# Altium project LED_driver_150W_LT3756-2.PrjPcb
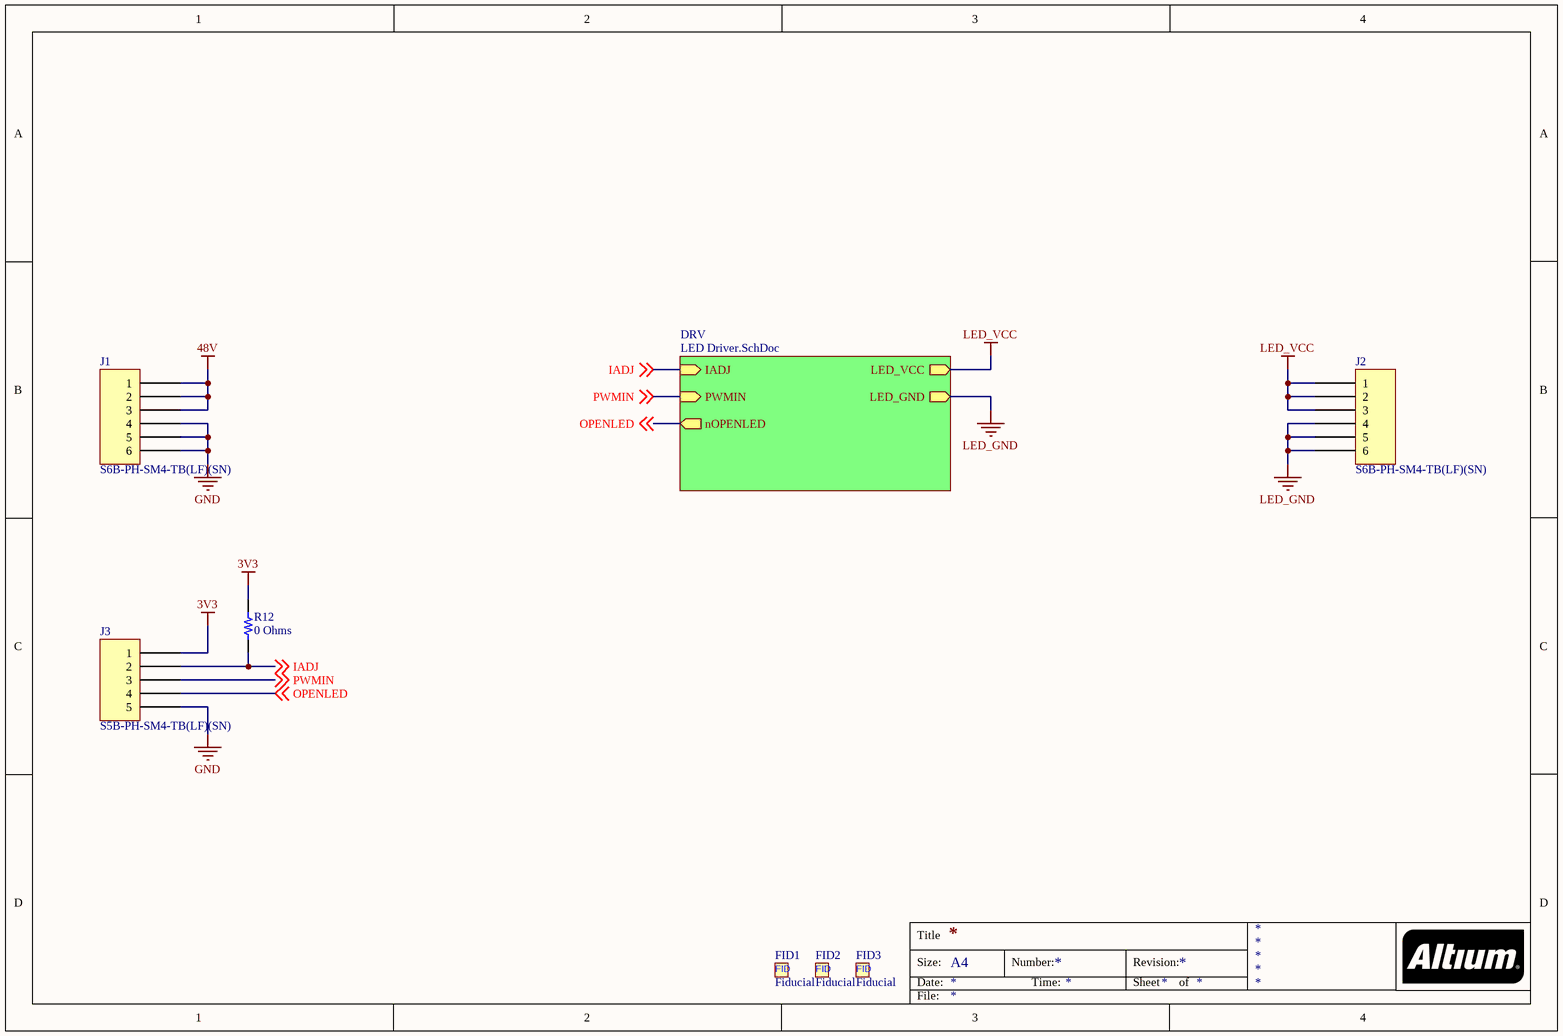
[diagram p0: Connections.SchDoc]
2 sheets, 37 parts. Net scope: hierarchical (ports join the sheet entries above them; power ports are global).
Board file: 150W LED Driver.PcbDoc
Sheets:
  Connections.SchDoc
    DRV = LED Driver.SchDoc

## Sheet Connections.SchDoc
size A4

### Parts
FID1  Fiducial  [Fiducial]  (no BOM)
FID2  Fiducial  [Fiducial]  (no BOM)
FID3  Fiducial  [Fiducial]  (no BOM)
J1  S6B-PH-SM4-TB(LF)(SN)  [JST S6B-PH-SM4-TB]
J2  S6B-PH-SM4-TB(LF)(SN)  [JST S6B-PH-SM4-TB]
J3  S5B-PH-SM4-TB(LF)(SN)  [JST S5B-PH-SM4-TB]
R12  0 Ohms  [RES 0603_1608]

### Sub-sheets
DRV = LED Driver.SchDoc: IADJ (in), nOPENLED (out), PWMIN (in), LED_VCC (out), LED_GND (out)

### Nets
3V3: J3.1 R12.2
48V: J1.1 J1.2 J1.3
GND: J1.4 J1.5 J1.6 J3.5
LED_GND: J2.4 J2.5 J2.6 ; sheet DRV/LED_GND
LED_VCC: J2.1 J2.2 J2.3 ; sheet DRV/LED_VCC  [project net ISN]
IADJ: J3.2 R12.1 ; off-sheet IADJ, sheet DRV/IADJ
OPENLED: J3.4 ; off-sheet OPENLED, sheet DRV/nOPENLED
PWMIN: J3.3 ; off-sheet PWMIN, sheet DRV/PWMIN

### Notes on the sheet
- Title
- Size:
- Date:
- A4
- Number:
- Time:
- Revision:
- Sheet
- of
- File:
- (in symbol Fiducial) FID

### Library data of the parts
J1 J2 = S6B-PH-SM4-TB(LF)(SN): CONN HEADER SMD R/A 6POS 2MM; Manufacturer: JST Sales America Inc.; Contact Length - Mating: 0.130" (3.30mm); Current Rating (Amps): 2A; Material Flammability Rating: UL94 V-0; Number of Positions: 6; Number of Positions Loaded: All; Pitch - Mating: 0.079" (2.00mm); Shrouding: Shrouded - 4 Wall; Style: Board to Cable/Wire; Voltage Rating: 100V; Part Number: S6B-PH-SM4-TB(LF)(SN); ComponentLink1Description: Datasheet; ComponentLink1URL: http://www.jst-mfg.com/product/pdf/eng/ePH.pdf; ComponentLink2Description: DigiKey Link; ComponentLink2URL: http://digikey.com/product-detail/en/jst-sales-america-inc/S6B-PH-SM4-TB-LF-SN/455-1753-1-ND/926850; Connector Type: Header; Contact Finish - Mating: Tin; Contact Finish - Post: Tin; Contact Material: Copper Alloy; Contact Shape: Square; Contact Type: Male Pin; Fastening Type: Detent Lock; Features: Solder Retention; Insulation Color: Natural; Insulation Height: 0.217" (5.51mm); Insulation Material: Polyamide (PA6T), Nylon 6T; LastUpdated: 15/01/2020 03:38:11; Lifecycle Status: Active; Minimum Order: 1; Mounting Type: Surface Mount, Right Angle; Number of Rows: 1; Operating Temperature: -25°C ~ 85°C; Packaging: TapeAndReel; PartId: 112; Part Status: Active; Price: 0.45; Series: PH; Supplier 1: DigiKey; Supplier Part Number 1: 455-1753-1-ND; Termination: Solder
J3 = S5B-PH-SM4-TB(LF)(SN): CONN HEADER SMD R/A 5POS 2MM; Manufacturer: JST Sales America Inc.; Contact Length - Mating: 0.130" (3.30mm); Current Rating (Amps): 2A; Material Flammability Rating: UL94 V-0; Number of Positions: 5; Number of Positions Loaded: All; Pitch - Mating: 0.079" (2.00mm); Shrouding: Shrouded - 4 Wall; Style: Board to Cable/Wire; Voltage Rating: 100V; Part Number: S5B-PH-SM4-TB(LF)(SN); ComponentLink1Description: Datasheet; ComponentLink1URL: http://www.jst-mfg.com/product/pdf/eng/ePH.pdf; ComponentLink2Description: DigiKey Link; ComponentLink2URL: http://digikey.com/product-detail/en/jst-sales-america-inc/S5B-PH-SM4-TB-LF-SN/455-1752-1-ND/926849; Connector Type: Header; Contact Finish - Mating: Tin; Contact Finish - Post: Tin; Contact Material: Copper Alloy; Contact Shape: Square; Contact Type: Male Pin; Fastening Type: Detent Lock; Features: Solder Retention; Insulation Color: Natural; Insulation Height: 0.217" (5.51mm); Insulation Material: Polyamide (PA6T), Nylon 6T; LastUpdated: 15/01/2020 03:45:44; Lifecycle Status: Active; Minimum Order: 1; Mounting Type: Surface Mount, Right Angle; Number of Rows: 1; Operating Temperature: -25°C ~ 85°C; Packaging: TapeAndReel; PartId: 118; Part Status: Active; Price: 0.39; Series: PH; Supplier 1: DigiKey; Supplier Part Number 1: 455-1752-1-ND; Termination: Solder
R12 = ERJ-3GEY0R00V: RES SMD 0 OHM JUMPER 1/10W 0603; Manufacturer: Panasonic Electronic Components; Power (Watts): 0.1W, 1/10W; Part Number: ERJ-3GEY0R00V; Value: 0 Ohms; ComponentLink1Description: Datasheet; ComponentLink1URL: http://industrial.panasonic.com/www-cgi/jvcr13pz.cgi?E+PZ+3+AOA0001+ERJ3GEY0R00V+7+WW; ComponentLink2Description: DigiKey Link; ComponentLink2URL: http://digikey.com/product-detail/en/panasonic-electronic-components/ERJ-3GEY0R00V/P0.0GCT-ND/134711; Composition: Thick Film; Device Package: 0603 (1608 Metric); Features: Automotive AEC-Q200; Height - Seated (Max): 0.022" (0.55mm); LastUpdated: 15/01/2020 00:08:11; Lifecycle Status: Active; Minimum Order: 1; Number of Terminations: 2; Operating Temperature: -55°C ~ 155°C; Package / Case: 0603 (1608 Metric); Packaging: TapeAndReel; PartId: 22603; Part Status: Active; Price: 0.01; Ratings: AEC-Q200; Resistance: 0 Ohms; Series: ERJ; Size / Dimension: 0.063" L x 0.031" W (1.60mm x 0.80mm); Supplier 1: DigiKey; Supplier Part Number 1: P0.0GCT-ND; Supplier Device Package: 0603; Tolerance: Jumper

## Sheet LED Driver.SchDoc: 150W LED Driver
size A4; DocumentNumber: 0; Revision: 0
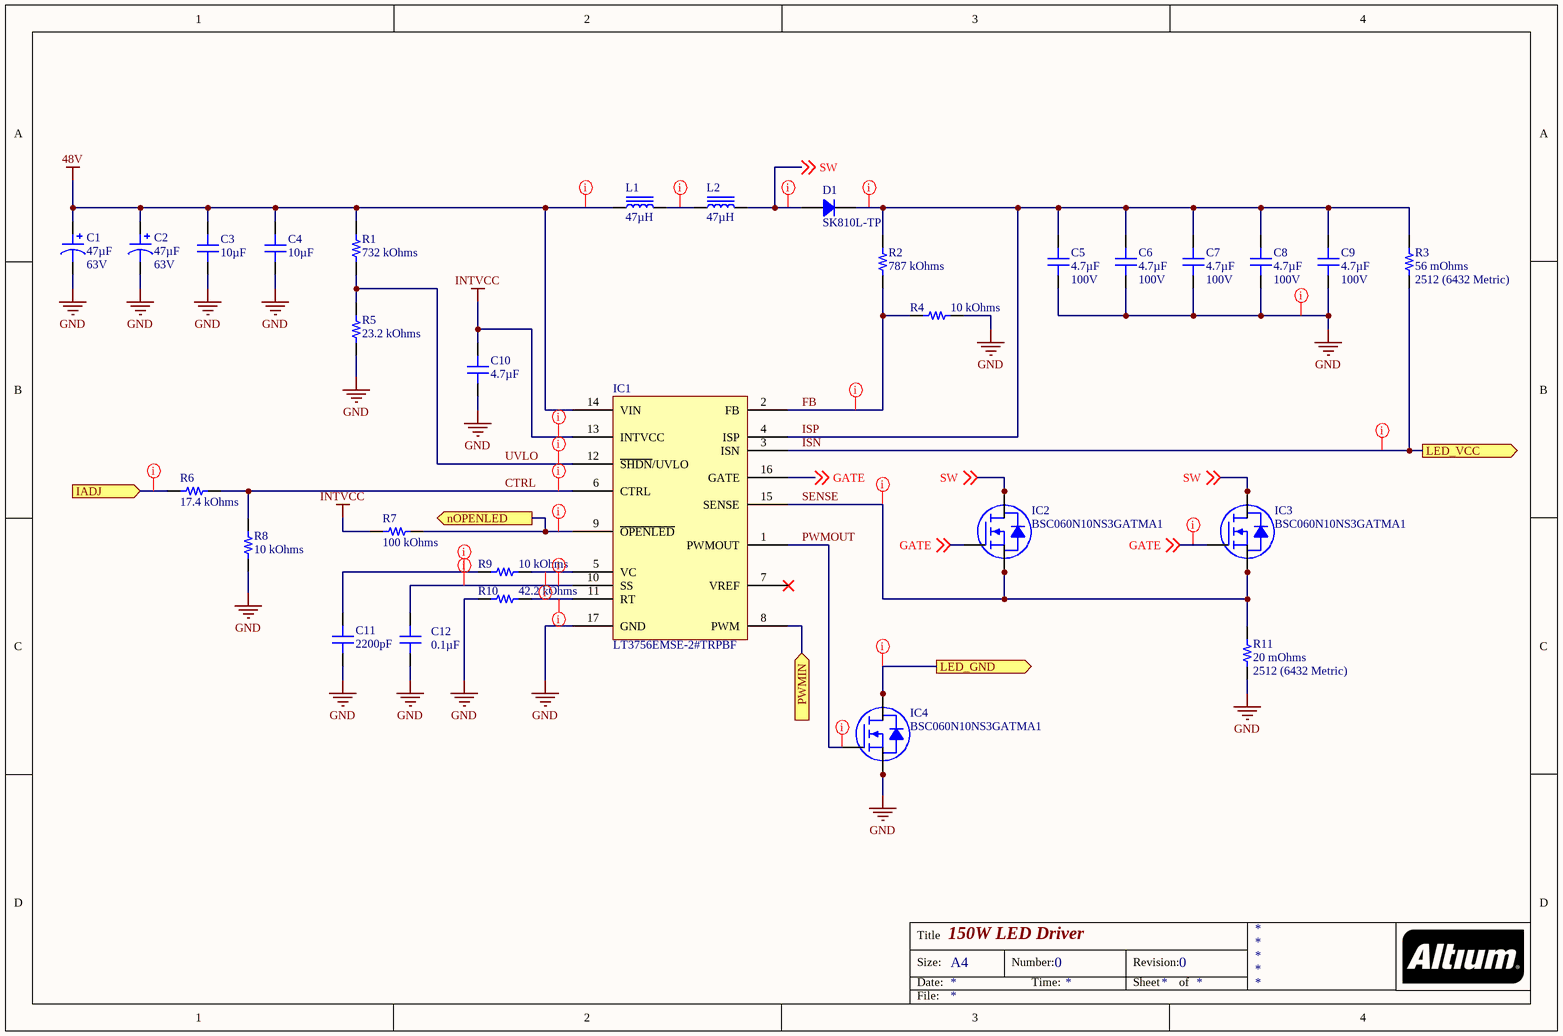
[diagram p1: LED Driver.SchDoc]

### Parts
C1  47µF  Voltage - Rated: 63V  [CAP ALSMD 8.3MM H10.5MM]
C2  47µF  Voltage - Rated: 63V  [CAP ALSMD 8.3MM H10.5MM]
C3  10µF  [CAP 1210_3225 - 2.8MM]
C4  10µF  [CAP 1210_3225 - 2.8MM]
C5  Voltage - Rated: 100V  [CAP 1210_3225 - 2.8MM]  (hidden comment: 4.7µF)
C6  Voltage - Rated: 100V  [CAP 1210_3225 - 2.8MM]  (hidden comment: 4.7µF)
C7  Voltage - Rated: 100V  [CAP 1210_3225 - 2.8MM]  (hidden comment: 4.7µF)
C8  Voltage - Rated: 100V  [CAP 1210_3225 - 2.8MM]  (hidden comment: 4.7µF)
C9  Voltage - Rated: 100V  [CAP 1210_3225 - 2.8MM]  (hidden comment: 4.7µF)
C10  4.7µF  [CAP 0402_1005]
C11  2200pF  [CAP 0402_1005]
C12  0.1µF  [CAP 0402_1005]
D1  SK810L-TP  [DO214AB SMC]
IC1  LT3756EMSE-2#TRPBF  [LTC MSOP-16 MSE16]
IC2  BSC060N10NS3GATMA1  [INFINEON PG-TDSON-8]
IC3  BSC060N10NS3GATMA1  [INFINEON PG-TDSON-8]
IC4  BSC060N10NS3GATMA1  [INFINEON PG-TDSON-8]
L1  47µH  [WURTH WE-HCF 14.5MM]
L2  47µH  [WURTH WE-HCF 14.5MM]
R1  732 kOhms  [RES 0402_1005]
R2  787 kOhms  [RES 0402_1005]
R3  56 mOhms  Package / Case: 2512 (6432 Metric)  [STACKPOLE CSR2512]
R4  10 kOhms  [RES 0402_1005]
R5  23.2 kOhms  [RES 0402_1005]
R6  17.4 kOhms  [RES 0402_1005]
R7  100 kOhms  [RES 0402_1005]
R8  10 kOhms  [RES 0402_1005]
R9  10 kOhms  [RES 0402_1005]
R10  42.2 kOhms  [RES 0402_1005]
R11  20 mOhms  Package / Case: 2512 (6432 Metric)  [STACKPOLE CSR2512]

### Ports
IADJ (in), LED_GND (out), LED_VCC (out), nOPENLED (out), PWMIN (in)

### Nets
48V: C1.1 C2.1 C3.2 C4.2 IC1.14(VIN) L1.1 R1.2
GND: C1.2 C2.2 C3.1 C4.1 C5.1 C6.1 C7.1 C8.1 C9.1 C10.1 C11.1 C12.1 IC1.17(GND) IC4.1(S) IC4.2(S) IC4.3(S) R4.1 R5.1 R8.1 R10.1 R11.1
INTVCC: C10.2 IC1.13(INTVCC) R7.1
ISN: IC1.3(ISN) R3.1 ; port LED_VCC
LED_GND: IC4.5(D) IC4.6(D) IC4.7(D) IC4.8(D) ; port LED_GND
CTRL: IC1.6(CTRL) R6.2 R8.2
FB: IC1.2(FB) R2.1 R4.2
GATE: IC1.16(GATE) IC2.4(G) IC3.4(G) ; off-sheet GATE
IADJ: R6.1 ; port IADJ
ISP: C5.2 C6.2 C7.2 C8.2 C9.2 D1.2 IC1.4(ISP) R2.2 R3.2
OPENLED: IC1.9(~{OPENLED}) R7.2 ; port nOPENLED
PWMIN: IC1.8(PWM) ; port PWMIN
PWMOUT: IC1.1(PWMOUT) IC4.4(G)
SENSE: IC1.15(SENSE) IC2.1(S) IC2.2(S) IC2.3(S) IC3.1(S) IC3.2(S) IC3.3(S) R11.2
SW: D1.1 IC2.5(D) IC2.6(D) IC2.7(D) IC2.8(D) IC3.5(D) IC3.6(D) IC3.7(D) IC3.8(D) L2.2 ; off-sheet SW
UVLO: IC1.12(~{SHDN}/UVLO) R1.1 R5.2
NetC11_2: C11.2 R9.2
NetC12_2: C12.2 IC1.10(SS)
NetIC1_5: IC1.5(VC) R9.1
NetIC1_11: IC1.11(RT) R10.2
NetL1_2: L1.2 L2.1

Not connected (* = marked no-connect by the designer): IC1 7(VREF)*

### Layout directives
net class HV: 48V, ISN, ISP, NetL1_2, SW
net class LP: CTRL, FB, GATE, GND, IADJ, INTVCC, LED_GND, NetC11_2, NetC12_2, NetIC1_5, NetIC1_11, OPENLED, PWMOUT, SENSE, UVLO

### Notes on the sheet
- Title
- Size:
- Date:
- A4
- Number:
- Time:
- Revision:
- Sheet
- of
- File:

### Library data of the parts
C1 C2 = 63SEV47M8X10.5: CAP ALUM 47UF 20% 63V SMD; Manufacturer: Rubycon; Lifetime @ Temp.: 2000 Hrs @ 85°C; Polarization: Polar; Ripple Current @ High Frequency: 255mA @ 10kHz; Ripple Current @ Low Frequency: 170mA @ 120Hz; Surface Mount Land Size: 0.327" L x 0.327" W (8.30mm x 8.30mm); Part Number: 63SEV47M8X10.5; Applications: Automotive; Capacitance: 47µF; ComponentLink1Description: Datasheet; ComponentLink1URL: http://www.rubycon.co.jp/en/catalog/e_pdfs/aluminum/e_sev.pdf; ComponentLink2Description: DigiKey Link; ComponentLink2URL: http://digikey.com/product-detail/en/rubycon/63SEV47M8X10.5/1189-2502-1-ND/4842406; Device Package: Radial, Can - SMD; Height - Seated (Max): 0.413" (10.50mm); LastUpdated: 14/01/2020 00:14:53; Lifecycle Status: Active; Minimum Order: 1; Mounting Type: Surface Mount; Operating Temperature: -40°C ~ 85°C; Package / Case: Radial, Can - SMD; Packaging: TapeAndReel; PartId: 7768; Part Status: Active; Price: 0.26; Ratings: AEC-Q200; Series: SEV; Size / Dimension: 0.315" Dia (8.00mm); Supplier 1: DigiKey; Supplier Part Number 1: 1189-2502-1-ND; Tolerance: ±20%; Value: 47µF
C3 C4 = CL32B106KMVNNWE: CAP CER 10UF 63V X7R 1210; Manufacturer: Samsung Electro-Mechanics; Tolerance: ±10%; Part Number: CL32B106KMVNNWE; Value: 10µF; Applications: General Purpose; Capacitance: 10µF; ComponentLink1Description: Datasheet; ComponentLink1URL: http://www.samsungsem.com/kr/support/product-search/mlcc/CL32B106KMVNNWE.jsp; ComponentLink2Description: DigiKey Link; ComponentLink2URL: http://digikey.com/product-detail/en/samsung-electro-mechanics/CL32B106KMVNNWE/1276-7053-1-ND/7320695; Device Package: 1210 (3225 Metric); LastUpdated: 14/01/2020 00:06:26; Lifecycle Status: Active; Minimum Order: 1; Mounting Type: Surface Mount, MLCC; Operating Temperature: -55°C ~ 125°C; Package / Case: 1210 (3225 Metric); Packaging: TapeAndReel; PartId: 23936; Part Status: Active; Price: 0.26; Series: CL; Size / Dimension: 0.126" L x 0.098" W (3.20mm x 2.50mm); Supplier 1: DigiKey; Supplier Part Number 1: 1276-7053-1-ND; Temperature Coefficient: X7R; Thickness (Max): 0.110" (2.80mm); Voltage - Rated: 63V
C5-C9 = HMK325BJ475KM-PE: CAP CER 4.7UF 100V X5R 1210; Manufacturer: Taiyo Yuden; Tolerance: ±10%; Part Number: HMK325BJ475KM-PE; Value: 4.7µF; Applications: SMPS Filtering; Capacitance: 4.7µF; ComponentLink1Description: Datasheet; ComponentLink1URL: http://www.yuden.co.jp/productdata/catalog/mlcc06_e.pdf; ComponentLink2Description: DigiKey Link; ComponentLink2URL: http://digikey.com/product-detail/en/taiyo-yuden/HMK325BJ475KM-PE/587-5034-1-ND/6563877; Device Package: 1210 (3225 Metric); LastUpdated: 14/01/2020 00:06:27; Lifecycle Status: Active; Minimum Order: 1; Mounting Type: Surface Mount, MLCC; Operating Temperature: -55°C ~ 85°C; Package / Case: 1210 (3225 Metric); Packaging: TapeAndReel; PartId: 23699; Part Status: Active; Price: 0.38; Series: M; Size / Dimension: 0.126" L x 0.098" W (3.20mm x 2.50mm); Supplier 1: DigiKey; Supplier Part Number 1: 587-5034-1-ND; Temperature Coefficient: X5R; Thickness (Max): 0.106" (2.70mm)
C10 = GRM155R61A475MEAAD: CAP CER 4.7UF 10V X5R 0402; Manufacturer: Murata Electronics; Tolerance: ±20%; Part Number: GRM155R61A475MEAAD; Applications: General Purpose; Capacitance: 4.7µF; ComponentLink1Description: Datasheet; ComponentLink1URL: https://search.murata.co.jp/Ceramy/image/img/A01X/G101/ENG/GRM155R61A475MEAA-01.pdf; ComponentLink2Description: DigiKey Link; ComponentLink2URL: //digikey.com/product-detail/en/murata-electronics/GRM155R61A475MEAAD/490-14306-2-ND/6234735; Device Package: 0402 (1005 Metric); LastUpdated: 29-Nov-19 20:59:51; Lifecycle Status: 0; Minimum Order: 1; Mounting Type: Surface Mount, MLCC; Operating Temperature: -55°C ~ 85°C; Package / Case: 0402 (1005 Metric); Packaging: TapeAndReel; PartId: 6746; Part Status: Active; Price: 0.03; Series: GRM; Size / Dimension: 0.039" L x 0.020" W (1.00mm x 0.50mm); Supplier 1: DigiKey; Supplier Part Number 1: 490-14306-2-ND; Temperature Coefficient: X5R; Thickness (Max): 0.026" (0.65mm); Value: 4.7µF; Voltage - Rated: 10V
C11 = GRM155R71H222JA01J: CAP CER 2200PF 50V X7R 0402; Manufacturer: Murata Electronics; Tolerance: ±5%; Part Number: GRM155R71H222JA01J; Value: 2200pF; Applications: General Purpose; Capacitance: 2200pF; ComponentLink1Description: Datasheet; ComponentLink1URL: https://www.murata.com/~/media/webrenewal/support/library/catalog/products/capacitor/mlcc/c02e.ashx?la=en-us; ComponentLink2Description: DigiKey Link; ComponentLink2URL: //digikey.com/product-detail/en/murata-electronics/GRM155R71H222JA01J/490-6359-2-ND/2610934; Device Package: 0402 (1005 Metric); LastUpdated: 29-Nov-19 20:59:47; Lifecycle Status: 0; Minimum Order: 1; Mounting Type: Surface Mount, MLCC; Operating Temperature: -55°C ~ 125°C; Package / Case: 0402 (1005 Metric); Packaging: TapeAndReel; PartId: 3973; Part Status: Active; Price: 0.00; Series: GRM; Size / Dimension: 0.039" L x 0.020" W (1.00mm x 0.50mm); Supplier 1: DigiKey; Supplier Part Number 1: 490-6359-2-ND; Temperature Coefficient: X7R; Thickness (Max): 0.022" (0.55mm); Voltage - Rated: 50V
C12 = EMK105BJ104MV-F: CAP CER 0.1UF 16V X5R 0402; Manufacturer: Taiyo Yuden; Tolerance: ±20%; Part Number: EMK105BJ104MV-F; Applications: General Purpose; Capacitance: 0.1µF; ComponentLink1Description: Datasheet; ComponentLink1URL: https://ds.yuden.co.jp/TYCOMPAS/ut/detail?pn=EMK105BJ104MV-F &u=M; ComponentLink2Description: DigiKey Link; ComponentLink2URL: //digikey.com/product-detail/en/taiyo-yuden/EMK105BJ104MV-F/587-5513-2-ND/6702361; Device Package: 0402 (1005 Metric); LastUpdated: 29-Nov-19 20:59:42; Lifecycle Status: 0; Minimum Order: 1; Mounting Type: Surface Mount, MLCC; Operating Temperature: -55°C ~ 85°C; Package / Case: 0402 (1005 Metric); Packaging: TapeAndReel; PartId: 1946; Part Status: Active; Price: 0.00; Series: M; Size / Dimension: 0.039" L x 0.020" W (1.00mm x 0.50mm); Supplier 1: DigiKey; Supplier Part Number 1: 587-5513-2-ND; Temperature Coefficient: X5R; Thickness (Max): 0.022" (0.55mm); Value: 0.1µF; Voltage - Rated: 16V
D1 = SK810L-TP: DIODE SCHOTTKY 100V 8A DO214AB; Manufacturer: Micro Commercial Co; Capacitance @ Vr, F: 400pF @ 4V, 1MHz; Current - Reverse Leakage @ Vr: 1mA @ 100V; Speed: Fast Recovery =< 500ns, > 200mA (Io); Voltage - Forward (Vf) (Max) @ If: 800mV @ 8A; Part Number: SK810L-TP; ComponentLink1Description: Datasheet; ComponentLink1URL: https://www.mccsemi.com/pdf/Products/SK82L-SK810L(SMC).PDF; ComponentLink2Description: DigiKey Link; ComponentLink2URL: http://digikey.com/product-detail/en/micro-commercial-co/SK810L-TP/SK810L-TPMSCT-ND/2650908; Current - Average Rectified (Io): 8A; Device Package: DO-214AB, SMC; Diode Type: Schottky; LastUpdated: 16/01/2020 00:15:26; Lifecycle Status: Active; Minimum Order: 1; Mounting Type: Surface Mount; Operating Temperature - Junction: -55°C ~ 150°C; Package / Case: DO-214AB, SMC; Packaging: TapeAndReel; PartId: 1759; Part Status: Active; Price: 0.22; Series: -; Supplier 1: DigiKey; Supplier Part Number 1: SK810L-TPMSCT-ND; Supplier Device Package: DO-214AB (SMC); Voltage - DC Reverse (Vr) (Max): 100V
IC1 = LT3756EMSE-2#TRPBF: IC LED DRIVER CTRLR DIM 16MSOP; Manufacturer: Linear Technology/Analog Devices; Dimming: Analog, PWM; Frequency: 100kHz ~ 1MHz; Internal Switch(s): No; Number of Outputs: 1; Topology: Flyback, SEPIC, Step-Down (Buck), Step-Up (Boost); Voltage - Output: 100V; Voltage - Supply (Min): 6V; Part Number: LT3756EMSE-2#TRPBF; ComponentLink1Description: Datasheet; ComponentLink1URL: http://www.linear.com/docs/26674; ComponentLink2Description: DigiKey Link; ComponentLink2URL: //digikey.com/product-detail/en/linear-technology-analog-devices/LT3756EMSE-2-TRPBF/LT3756EMSE-2-TRPBFTR-ND/2107813; Device Package: 16-TFSOP (0.118", 3.00mm Width) Exposed Pad; LastUpdated: 09-Dec-19 01:26:27; Lifecycle Status: 0; Minimum Order: 1; Mounting Type: Surface Mount; Operating Temperature: -40°C ~ 125°C (TJ); Package / Case: 16-TFSOP (0.118", 3.00mm Width) Exposed Pad; Packaging: TapeAndReel; PartId: 5; Part Status: Active; Price: 4.07; Series: -; Supplier 1: DigiKey; Supplier Part Number 1: LT3756EMSE-2#TRPBFTR-ND; Supplier Device Package: 16-MSOP-EP; Type: DC DC Controller; Voltage - Supply (Max): 100V
IC2-IC4 = BSC060N10NS3GATMA1: MOSFET N-CH 100V 90A TDSON-8; Manufacturer: Infineon Technologies; Current - Continuous Drain (Id) @ 25°C: 14.9A (Ta), 90A (Tc); Drive Voltage (Max Rds On,  Min Rds On): 6V, 10V; FET Type: N-Channel; Gate Charge (Qg) (Max) @ Vgs: 68nC @ 10V; Input Capacitance (Ciss) (Max) @ Vds: 4900pF @ 50V; Power Dissipation (Max): 125W (Tc); Rds On (Max) @ Id, Vgs: 6mOhm @ 50A, 10V; Vgs (Max): ±20V; Vgs(th) (Max) @ Id: 3.5V @ 90µA; Part Number: BSC060N10NS3GATMA1; ComponentLink1Description: Datasheet; ComponentLink1URL: https://www.infineon.com/dgdl/BSC060N10NS3+Rev2.4.pdf?folderId=db3a304313b8b5a60113cee8763b02d7&fileId=db3a30431ce5fb52011d1aab7f90133a; ComponentLink2Description: DigiKey Link; ComponentLink2URL: //digikey.com/product-detail/en/infineon-technologies/BSC060N10NS3GATMA1/BSC060N10NS3GATMA1TR-ND/2080630; Device Package: 8-PowerTDFN; Drain to Source Voltage (Vdss): 100V; LastUpdated: 14-Dec-19 18:17:59; Lifecycle Status: 0; Minimum Order: 1; Mounting Type: Surface Mount; Operating Temperature: -55°C ~ 150°C (TJ); Package / Case: 8-PowerTDFN; Packaging: TapeAndReel; Part Status: Active; Price: 1.25; Series: OptiMOS™; Supplier 1: DigiKey; Supplier Part Number 1: BSC060N10NS3GATMA1TR-ND; Supplier Device Package: PG-TDSON-8-1; Technology: MOSFET (Metal Oxide)
L1 L2 = 7443634700: FIXED IND 47UH 12A 12.2 MOHM SMD; Manufacturer: Würth Elektronik; Current - Saturation: 8.5A; Frequency - Self Resonant: 10MHz; Inductance Frequency - Test: 100kHz; Material - Core: Manganese Zinc Ferrite (MnZn); Shielding: Shielded; Tolerance: ±15%; Type: Wirewound; Part Number: 7443634700; ComponentLink1Description: Datasheet; ComponentLink1URL: https://katalog.we-online.de/pbs/datasheet/7443634700.pdf; ComponentLink2Description: DigiKey Link; ComponentLink2URL: http://digikey.com/product-detail/en/w-rth-elektronik/7443634700/732-2525-1-ND/2440408; Current Rating (Amps): 12A; DC Resistance (DCR): 12.2mOhm; Device Package: Nonstandard; Height - Seated (Max): 0.571" (14.50mm); Inductance: 47µH; LastUpdated: 14/01/2020 00:14:51; Lifecycle Status: Active; Minimum Order: 1; Mounting Type: Surface Mount; Operating Temperature: -40°C ~ 125°C; Package / Case: Nonstandard; Packaging: TapeAndReel; PartId: 3230; Part Status: Active; Price: 5.04; Series: WE-HCF; Size / Dimension: 0.858" L x 0.846" W (21.80mm x 21.50mm); Supplier 1: DigiKey; Supplier Part Number 1: 732-2525-1-ND; Value: 47µH
R1 = ERJ-2RKF7323X: RES SMD 732K OHM 1% 1/10W 0402; Manufacturer: Panasonic Electronic Components; Power (Watts): 0.1W, 1/10W; Temperature Coefficient: ±100ppm/°C; Part Number: ERJ-2RKF7323X; Value: 732 kOhms; ComponentLink1Description: Datasheet; ComponentLink1URL: https://industrial.panasonic.com/cdbs/www-data/pdf/RDA0000/AOA0000C304.pdf; ComponentLink2Description: DigiKey Link; ComponentLink2URL: http://digikey.com/product-detail/en/panasonic-electronic-components/ERJ-2RKF7323X/P732KLCT-ND/194512; Composition: Thick Film; Device Package: 0402 (1005 Metric); Features: Automotive AEC-Q200; Height - Seated (Max): 0.016" (0.40mm); LastUpdated: 16/01/2020 05:37:05; Lifecycle Status: Active; Minimum Order: 1; Number of Terminations: 2; Operating Temperature: -55°C ~ 155°C; Package / Case: 0402 (1005 Metric); Packaging: CutTape; PartId: 6419; Part Status: Active; Price: 0.10; Ratings: AEC-Q200; Resistance: 732 kOhms; Series: ERJ; Size / Dimension: 0.039" L x 0.020" W (1.00mm x 0.50mm); Supplier 1: DigiKey; Supplier Part Number 1: P732KLCT-ND; Supplier Device Package: 0402; Tolerance: ±1%
R2 = ERJ-2RKF7873X: RES SMD 787K OHM 1% 1/10W 0402; Manufacturer: Panasonic Electronic Components; Power (Watts): 0.1W, 1/10W; Temperature Coefficient: ±100ppm/°C; Part Number: ERJ-2RKF7873X; Value: 787 kOhms; ComponentLink1Description: Datasheet; ComponentLink1URL: https://industrial.panasonic.com/cdbs/www-data/pdf/RDA0000/AOA0000C304.pdf; ComponentLink2Description: DigiKey Link; ComponentLink2URL: http://digikey.com/product-detail/en/panasonic-electronic-components/ERJ-2RKF7873X/P787KLCT-ND/194524; Composition: Thick Film; Device Package: 0402 (1005 Metric); Features: Automotive AEC-Q200; Height - Seated (Max): 0.016" (0.40mm); LastUpdated: 14/01/2020 00:04:33; Lifecycle Status: Active; Minimum Order: 1; Number of Terminations: 2; Operating Temperature: -55°C ~ 155°C; Package / Case: 0402 (1005 Metric); Packaging: CutTape; PartId: 6458; Part Status: Active; Price: 0.10; Ratings: AEC-Q200; Resistance: 787 kOhms; Series: ERJ; Size / Dimension: 0.039" L x 0.020" W (1.00mm x 0.50mm); Supplier 1: DigiKey; Supplier Part Number 1: P787KLCT-ND; Supplier Device Package: 0402; Tolerance: ±1%
R3 = KRL3264-C-R056-F-T1: RES 0.056 OHM 1% 1W 3264; Manufacturer: Susumu; Temperature Coefficient: ±50ppm/°C; Part Number: KRL3264-C-R056-F-T1; ComponentLink1Description: Datasheet; ComponentLink1URL: http://www.susumu.co.jp/common/pdf/usa_products_21.pdf; ComponentLink2Description: DigiKey Link; ComponentLink2URL: http://digikey.com/product-detail/en/susumu/KRL3264-C-R056-F-T1/KRL32C.056CT-ND/1936086; Composition: Metal Foil; Device Package: 2512 (6432 Metric); Features: Automotive AEC-Q200, Current Sense; Height - Seated (Max): 0.028" (0.70mm); LastUpdated: 14/01/2020 00:10:54; Lifecycle Status: Active; Minimum Order: 1; Number of Terminations: 2; Operating Temperature: -55°C ~ 175°C; Packaging: TapeAndReel; PartId: 1808; Part Status: Active; Power (Watts): 1W; Price: 0.19; Ratings: AEC-Q200; Resistance: 56 mOhms; Series: KRL; Size / Dimension: 0.248" L x 0.122" W (6.30mm x 3.10mm); Supplier 1: DigiKey; Supplier Part Number 1: KRL32C.056CT-ND; Supplier Device Package: 3264; Tolerance: ±1%; Value: 56 mOhms
R4 R8 R9 = ERJ-2RKF1002X: RES SMD 10K OHM 1% 1/10W 0402; Manufacturer: Panasonic Electronic Components; Power (Watts): 0.1W, 1/10W; Temperature Coefficient: ±100ppm/°C; Part Number: ERJ-2RKF1002X; Value: 10 kOhms; ComponentLink1Description: Datasheet; ComponentLink1URL: https://industrial.panasonic.com/cdbs/www-data/pdf/RDA0000/AOA0000C304.pdf; ComponentLink2Description: DigiKey Link; ComponentLink2URL: http://digikey.com/product-detail/en/panasonic-electronic-components/ERJ-2RKF1002X/P10.0KLCT-ND/194119; Composition: Thick Film; Device Package: 0402 (1005 Metric); Features: Automotive AEC-Q200; Height - Seated (Max): 0.016" (0.40mm); LastUpdated: 14/01/2020 00:04:08; Lifecycle Status: Active; Minimum Order: 1; Number of Terminations: 2; Operating Temperature: -55°C ~ 155°C; Package / Case: 0402 (1005 Metric); Packaging: CutTape; PartId: 19601; Part Status: Active; Price: 0.10; Ratings: AEC-Q200; Resistance: 10 kOhms; Series: ERJ; Size / Dimension: 0.039" L x 0.020" W (1.00mm x 0.50mm); Supplier 1: DigiKey; Supplier Part Number 1: P10.0KLCT-ND; Supplier Device Package: 0402; Tolerance: ±1%
R5 = ERJ-2RKF2322X: RES SMD 23.2K OHM 1% 1/10W 0402; Manufacturer: Panasonic Electronic Components; Power (Watts): 0.1W, 1/10W; Temperature Coefficient: ±100ppm/°C; Part Number: ERJ-2RKF2322X; Value: 23.2 kOhms; ComponentLink1Description: Datasheet; ComponentLink1URL: https://industrial.panasonic.com/cdbs/www-data/pdf/RDA0000/AOA0000C304.pdf; ComponentLink2Description: DigiKey Link; ComponentLink2URL: http://digikey.com/product-detail/en/panasonic-electronic-components/ERJ-2RKF2322X/P23.2KLCT-ND/194275; Composition: Thick Film; Device Package: 0402 (1005 Metric); Features: Automotive AEC-Q200; Height - Seated (Max): 0.016" (0.40mm); LastUpdated: 14/01/2020 00:04:05; Lifecycle Status: Active; Minimum Order: 1; Number of Terminations: 2; Operating Temperature: -55°C ~ 155°C; Package / Case: 0402 (1005 Metric); Packaging: CutTape; PartId: 21321; Part Status: Active; Price: 0.10; Ratings: AEC-Q200; Resistance: 23.2 kOhms; Series: ERJ; Size / Dimension: 0.039" L x 0.020" W (1.00mm x 0.50mm); Supplier 1: DigiKey; Supplier Part Number 1: P23.2KLCT-ND; Supplier Device Package: 0402; Tolerance: ±1%
R6 = ERJ-2RKF1742X: RES SMD 17.4K OHM 1% 1/10W 0402; Manufacturer: Panasonic Electronic Components; Power (Watts): 0.1W, 1/10W; Temperature Coefficient: ±100ppm/°C; Part Number: ERJ-2RKF1742X; Value: 17.4 kOhms; ComponentLink1Description: Datasheet; ComponentLink1URL: https://industrial.panasonic.com/cdbs/www-data/pdf/RDA0000/AOA0000C304.pdf; ComponentLink2Description: DigiKey Link; ComponentLink2URL: http://digikey.com/product-detail/en/panasonic-electronic-components/ERJ-2RKF1742X/P17.4KLCT-ND/194209; Composition: Thick Film; Device Package: 0402 (1005 Metric); Features: Automotive AEC-Q200; Height - Seated (Max): 0.016" (0.40mm); LastUpdated: 14/01/2020 00:04:33; Lifecycle Status: Active; Minimum Order: 1; Number of Terminations: 2; Operating Temperature: -55°C ~ 155°C; Package / Case: 0402 (1005 Metric); Packaging: CutTape; PartId: 6542; Part Status: Active; Price: 0.10; Ratings: AEC-Q200; Resistance: 17.4 kOhms; Series: ERJ; Size / Dimension: 0.039" L x 0.020" W (1.00mm x 0.50mm); Supplier 1: DigiKey; Supplier Part Number 1: P17.4KLCT-ND; Supplier Device Package: 0402; Tolerance: ±1%
R7 = ERJ-PA2J104X: RES SMD 100K OHM 5% 1/5W 0402; Manufacturer: Panasonic Electronic Components; Power (Watts): 0.2W, 1/5W; Temperature Coefficient: ±200ppm/°C; Part Number: ERJ-PA2J104X; Value: 100 kOhms; ComponentLink1Description: Datasheet; ComponentLink1URL: https://industrial.panasonic.com/cdbs/www-data/pdf/RDO0000/AOA0000C331.pdf; ComponentLink2Description: DigiKey Link; ComponentLink2URL: http://digikey.com/product-detail/en/panasonic-electronic-components/ERJ-PA2J104X/P17205CT-ND/5402693; Composition: Thick Film; Device Package: 0402 (1005 Metric); Features: Automotive AEC-Q200, Pulse Withstanding; Height - Seated (Max): 0.016" (0.40mm); LastUpdated: 14/01/2020 00:04:10; Lifecycle Status: Active; Minimum Order: 1; Number of Terminations: 2; Operating Temperature: -55°C ~ 155°C; Package / Case: 0402 (1005 Metric); Packaging: TapeAndReel; PartId: 18595; Part Status: Active; Price: 0.01; Ratings: AEC-Q200; Resistance: 100 kOhms; Series: ERJ; Size / Dimension: 0.039" L x 0.020" W (1.00mm x 0.50mm); Supplier 1: DigiKey; Supplier Part Number 1: P17205CT-ND; Supplier Device Package: 0402; Tolerance: ±5%
R10 = ERJ-2RKF4222X: RES SMD 42.2K OHM 1% 1/10W 0402; Manufacturer: Panasonic Electronic Components; Power (Watts): 0.1W, 1/10W; Temperature Coefficient: ±100ppm/°C; Part Number: ERJ-2RKF4222X; Value: 42.2 kOhms; ComponentLink1Description: Datasheet; ComponentLink1URL: https://industrial.panasonic.com/cdbs/www-data/pdf/RDA0000/AOA0000C304.pdf; ComponentLink2Description: DigiKey Link; ComponentLink2URL: http://digikey.com/product-detail/en/panasonic-electronic-components/ERJ-2RKF4222X/P42.2KLCT-ND/194399; Composition: Thick Film; Device Package: 0402 (1005 Metric); Features: Automotive AEC-Q200; Height - Seated (Max): 0.016" (0.40mm); LastUpdated: 14/01/2020 00:04:38; Lifecycle Status: Active; Minimum Order: 1; Number of Terminations: 2; Operating Temperature: -55°C ~ 155°C; Package / Case: 0402 (1005 Metric); Packaging: CutTape; PartId: 3877; Part Status: Active; Price: 0.10; Ratings: AEC-Q200; Resistance: 42.2 kOhms; Series: ERJ; Size / Dimension: 0.039" L x 0.020" W (1.00mm x 0.50mm); Supplier 1: DigiKey; Supplier Part Number 1: P42.2KLCT-ND; Supplier Device Package: 0402; Tolerance: ±1%
R11 = CSRN2512FK20L0: RES 0.02 OHM 1% 2W 2512; Manufacturer: Stackpole Electronics Inc; Temperature Coefficient: ±200ppm/°C; Part Number: CSRN2512FK20L0; ComponentLink1Description: Datasheet; ComponentLink1URL: https://www.seielect.com/catalog/sei-csr_csrn.pdf; ComponentLink2Description: DigiKey Link; ComponentLink2URL: http://digikey.com/product-detail/en/stackpole-electronics-inc/CSRN2512FK20L0/CSRN2512FK20L0CT-ND/1646253; Composition: Thick Film; Device Package: 2512 (6432 Metric); Features: Current Sense; Height - Seated (Max): 0.028" (0.70mm); LastUpdated: 14/01/2020 00:10:55; Lifecycle Status: Active; Minimum Order: 1; Number of Terminations: 2; Operating Temperature: -55°C ~ 155°C; Packaging: TapeAndReel; PartId: 1775; Part Status: Active; Power (Watts): 2W; Price: 0.16; Resistance: 20 mOhms; Series: CSRN; Size / Dimension: 0.250" L x 0.124" W (6.35mm x 3.15mm); Supplier 1: DigiKey; Supplier Part Number 1: CSRN2512FK20L0CT-ND; Supplier Device Package: 2512; Tolerance: ±1%; Value: 20 mOhms

## Nets that join several sheets
48V: Connections (J1.1 J1.2 J1.3), LED Driver (7 pins)
GND: Connections (J1.4 J1.5 J1.6 J3.5), LED Driver (21 pins)
ISN: Connections (J2.1 J2.2 J2.3), LED Driver (IC1.3 R3.1)
LED_GND: Connections (J2.4 J2.5 J2.6), LED Driver (IC4.5 IC4.6 IC4.7 IC4.8)
IADJ: Connections (J3.2 R12.1), LED Driver (R6.1)
OPENLED: Connections (J3.4), LED Driver (IC1.9 R7.2)
PWMIN: Connections (J3.3), LED Driver (IC1.8)